# EAGLE design PressureSensorAdaptor (EAGLE 7.2.0)
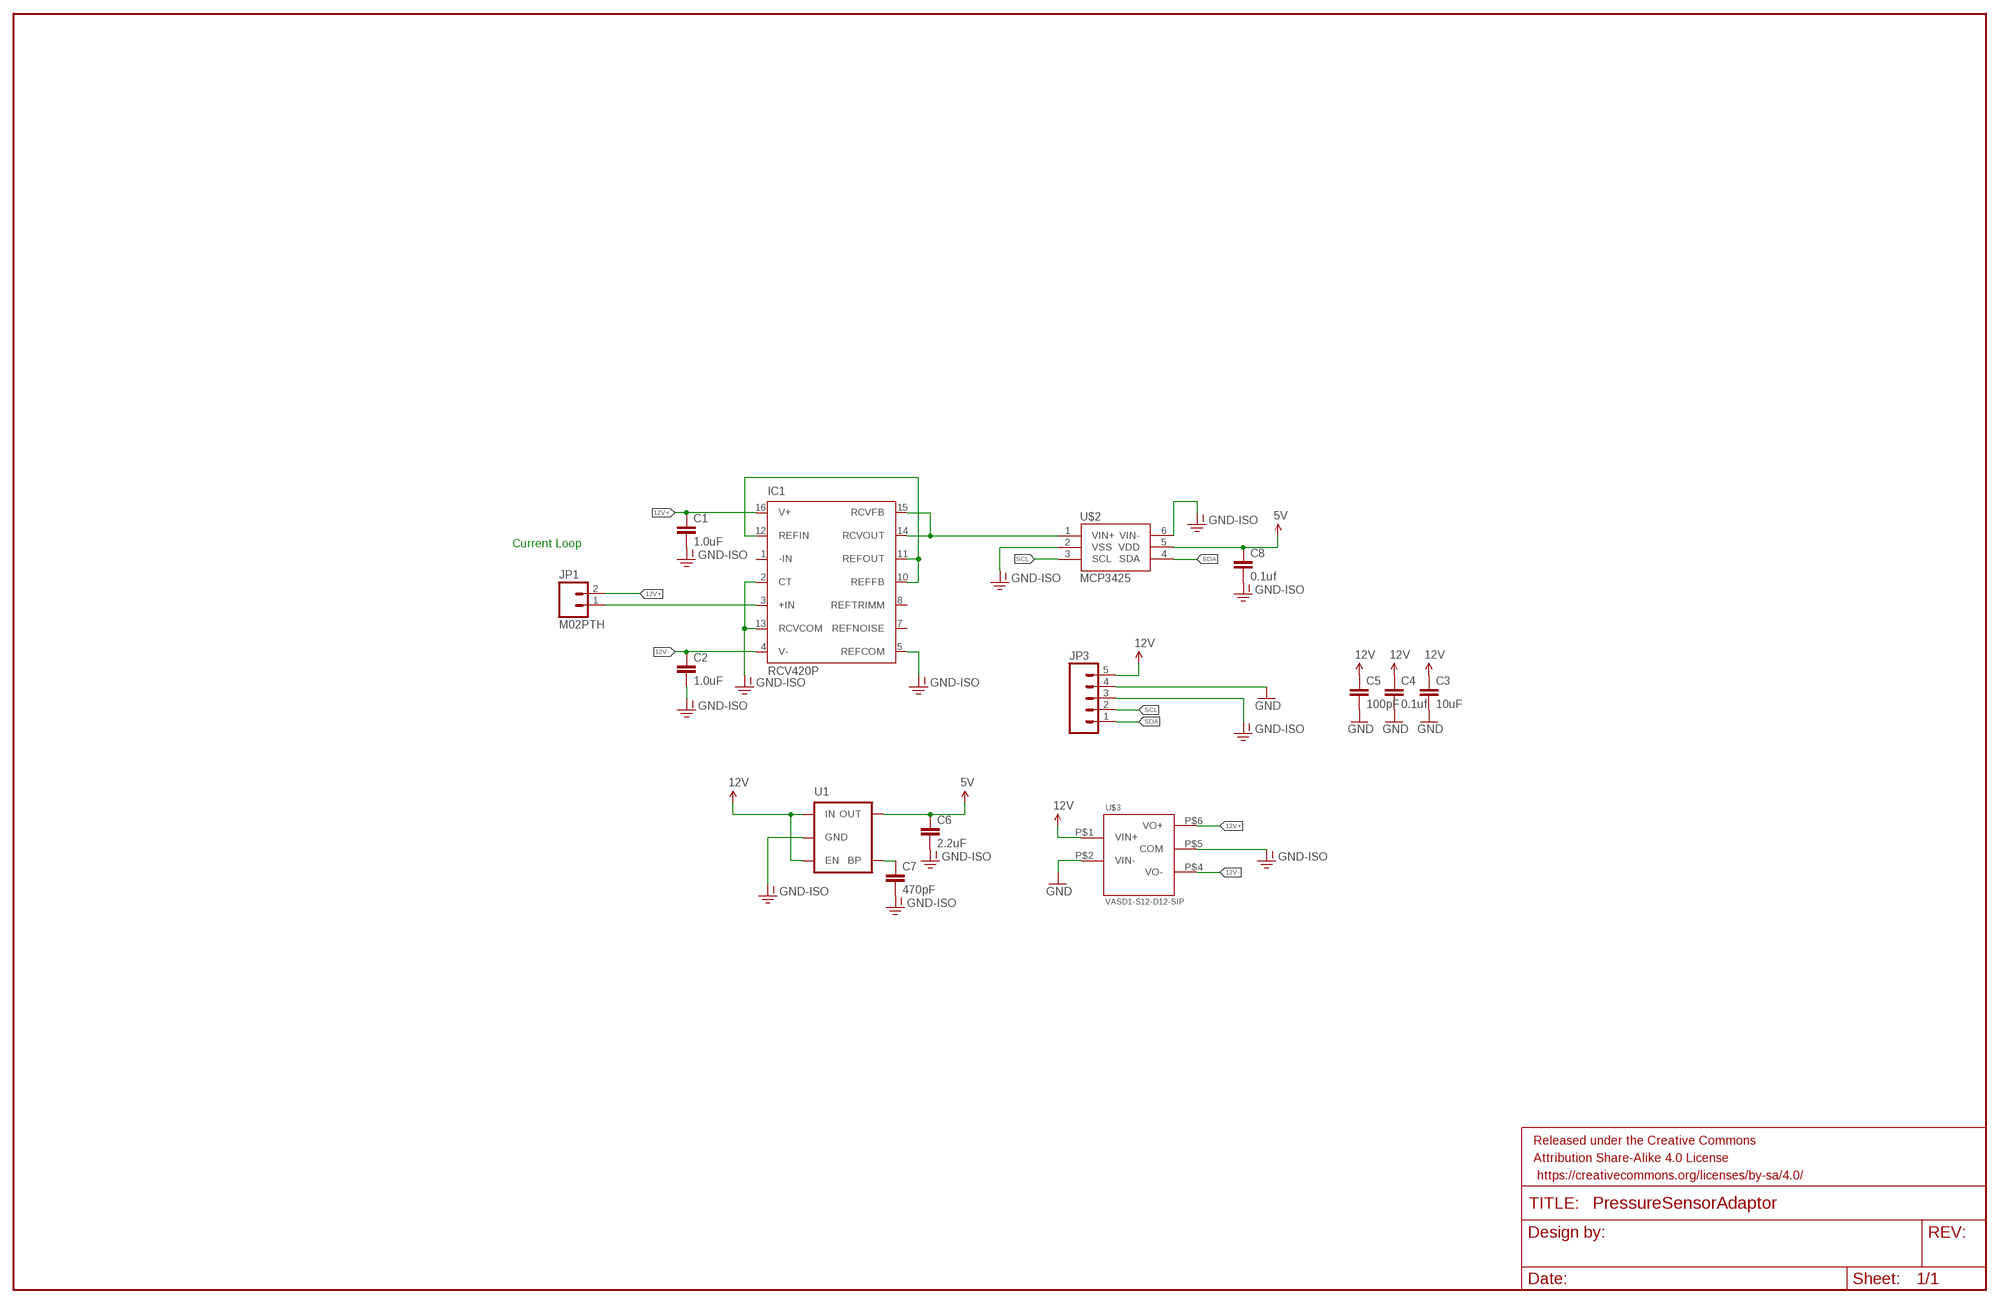
[diagram p0: schematic, sheet 1]

## Parts
C1  1.0uF  1.0UF-25V-+80/-20(0805)  [0805]
C2  1.0uF  1.0UF-25V-+80/-20(0805)  [0805]
C3  10uF  CAP0805  [0805]
C4  0.1uf  CAP0805  [0805]
C5  100pF  CAP0805  [0805]
C6  2.2uF  2.2UF-25V-+80/-20(0805)  [0805]
C7  470pF  470PF-50V-5%(0603)SMD  [0603-CAP]
C8  0.1uf  CAP0805  [0805]
FRAME1  FRAME-LEDGER  [CREATIVE_COMMONS]
IC1  RCV420P  [DIL16]
JP1  M02PTH  [1X02]
JP3  M05PTH  [1X05]
U1  MIC52055V  [SOT23-5]
U$2  MCP3425  [SOT23-6]
U$3  VASD1-S12-D12-SIP  [VASD1-S12-D12-SIP]

## Nets
5V: C6.1 C8.1 U1.5(OUT) U$2.5(VDD)
12V: C3.1 C4.1 C5.1 JP3.5 U1.1(IN) U1.3(EN) U$3.P$1(VIN+)
12V+: C1.1 IC1.16(V+) JP1.2 U$3.P$6(VO+)
12V-: C2.1 IC1.4(V-) U$3.P$4(VO-)
GND: C3.2 C4.2 C5.2 JP3.4 U$3.P$2(VIN-)
GND-ISO: C1.2 C2.2 C6.2 C7.2 C8.2 IC1.2(CT) IC1.5(REFCOM) IC1.13(RCVCOM) JP3.3 U1.2(GND) U$2.2(VSS) U$2.6(VIN-) U$3.P$5(COM)
N$1: IC1.10(REFFB) IC1.11(REFOUT) IC1.12(REFIN)
N$2: IC1.3(+IN) JP1.1
N$11: C7.1 U1.4(BP)
SCL: JP3.2 U$2.3(SCL)
SDA: JP3.1 U$2.4(SDA)
VOUT: IC1.14(RCVOUT) IC1.15(RCVFB) U$2.1(VIN+)
Unconnected: IC1.1(-IN) IC1.7(REFNOISE) IC1.8(REFTRIMM)

## Notes on the sheet
- Current Loop

## Library data of the parts
C1 C2 = SparkFun-Capacitors:1.0UF-25V-+80/-20(0805): CAP-11625; PROD_ID: CAP-11625
C3 = SparkFun-Capacitors:CAP: Capacitor Standard 0603 ceramic capacitor, and 0.1" leaded capacitor.; DIGIKEY: 490-3886-1-ND
C4 C5 C8 = SparkFun-Capacitors:CAP: Capacitor Standard 0603 ceramic capacitor, and 0.1" leaded capacitor.
C6 = SparkFun-Capacitors:2.2UF-25V-+80/-20(0805): CAP-11624; PROD_ID: CAP-11624
C7 = SparkFun-Capacitors:470PF-50V-5%(0603): CAP-07884; PROD_ID: CAP-07884
FRAME1 = SparkFun-Aesthetics:FRAME-LEDGER: Schematic Frame Standard 11x14 US Ledger frame; DESIGNER: Roy Cohen; VERSION: A
IC1 = burr-brown:RCV420: Precision 4mA to 20mA CURRENT LOOP RECEIVER Source: http://focus.ti.com/lit/ds/symlink/rcv420.pdf; MF: TEXAS INSTRUMENTS; MPN: RCV420JP; OC_FARNELL: 1212342; OC_NEWARK: 60K6765
JP1 = SparkFun-Connectors:M02: Standard 2-pin 0.1" header. Use with - straight break away headers ( PRT-00116) - right angle break away headers (PRT-00553) - swiss pins (PRT-00743) - machine pins (PRT-00117) - female headers (PRT-00115) Molex polarized connector foot print use with: PRT-08233 with associated crimp pins and housings. 2.54_SCREWTERM for use with PRT-10571. 3.5mm Screw Terminal footprints for PRT-08084 5mm Screw Terminal footprints for use with PRT-08432
JP3 = SparkFun-Connectors:M05: Header 5 Standard 5-pin 0.1" header. Use with straight break away headers (SKU : PRT-00116), right angle break away headers (PRT-00553), swiss pins (PRT-00743), machine pins (PRT-00117), and female headers (PRT-00115). Molex polarized connector foot print use with SKU : PRT-08230 with associated crimp pins and housings.
U1 = SparkFun-PowerIC:MIC5205: MIC5205 150mA vreg 3.3V - VREG-00822 5V - VREG-00823; PROD_ID: VREG-00823
U$2 = RitLaunchInitiative:MCP3425: Single channel ADC http://ww1.microchip.com/downloads/en/DeviceDoc/22072b.pdf
U$3 = RitLaunchInitiative:VASD1-S12-D12-SIP: DC to DC converter 12v to +12v, -12v http://www.cui.com/product/resource/vasd1-sip.pdf

## Board
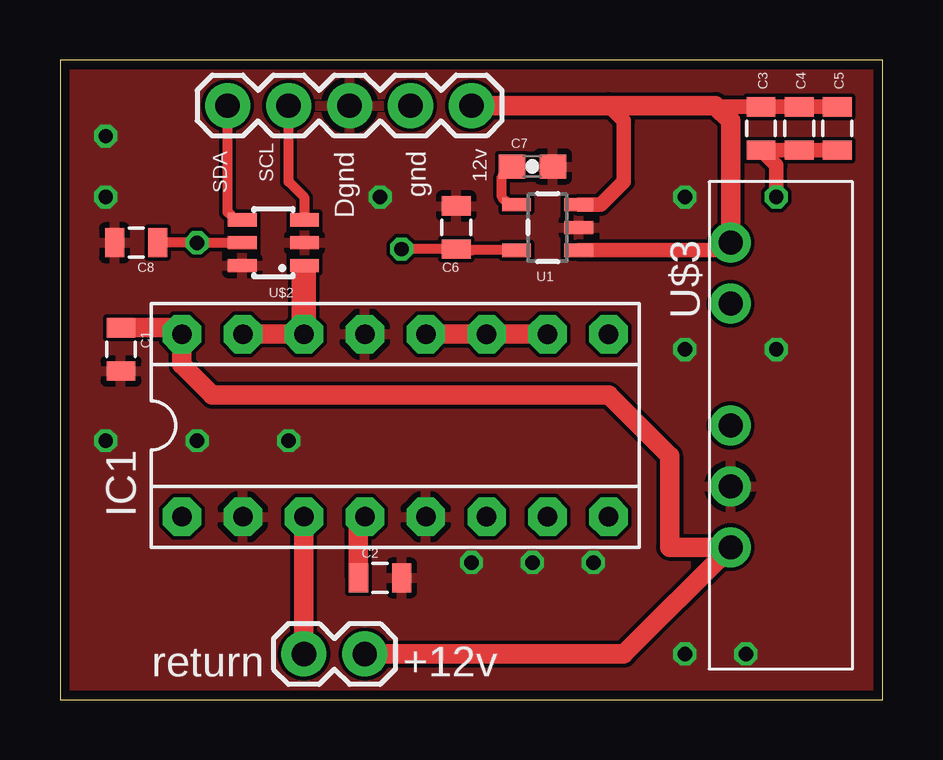
[diagram p1: board, top side]
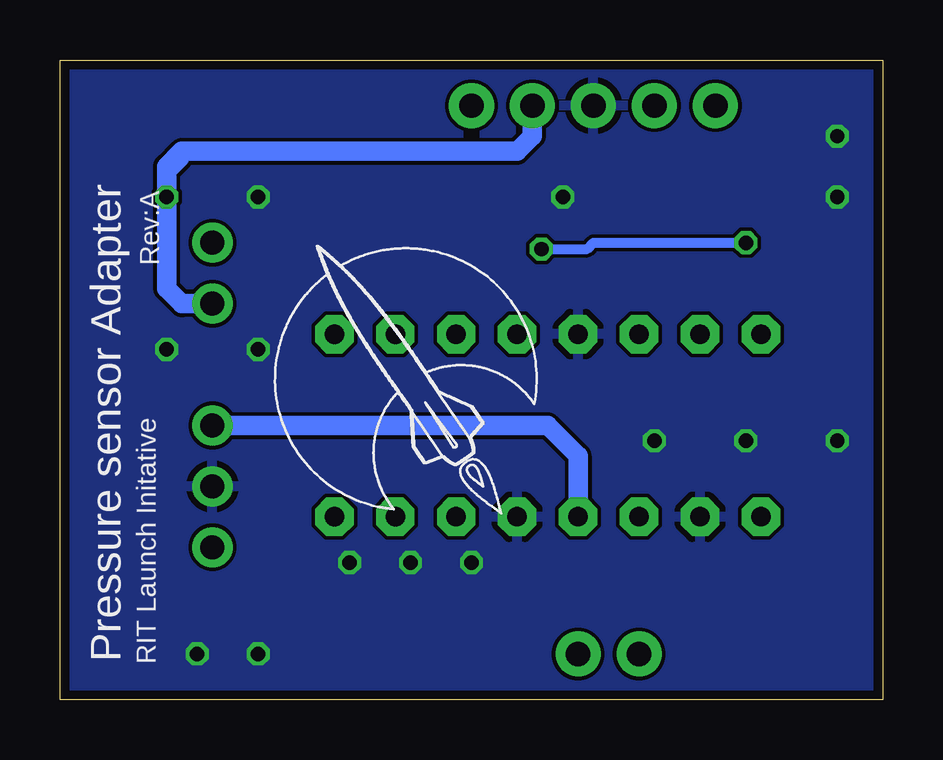
[diagram p2: board, bottom side, seen from below]

Size 34.29 x 26.67 mm. Coordinates in mm from the lower left corner, seen from the top.
Outline: 0,0 34.29,0 34.29,26.67 0,26.67 0,0
Copper layers (1*16): Top 0.0356mm / dielectric 1.5011mm / Bottom 0.0356mm
Design rules "LaenPCBOrder *": minimum track width 6mil, minimum drill 13mil, track to track 6mil, track to pad 6mil, pad to pad 6mil, via to via 6mil, smd to smd 6mil, copper to edge 15mil, drill to drill 6mil, minimum pad ring 7mil, minimum via ring 7mil, stop-mask expansion 3mil, vias tented up to drill 15mil, thermal gap 10mil

### Footprints (pad centres in the part's own frame; a part is rotated, then mirrored left to right if it is on the bottom)
0805 = smd 0.8 x 1.2: 1 -0.9,0; 2 0.9,0
0603-CAP = smd 1.1 x 1: 1 -0.85,0; 2 0.85,0
DIL16 = drill 0.813 pad 1.6 octagon: 1 -8.89,-3.81; 2 -6.35,-3.81; 3 -3.81,-3.81; 4 -1.27,-3.81; 5 1.27,-3.81; 6 3.81,-3.81; 7 6.35,-3.81; 8 8.89,-3.81; 9 8.89,3.81; 10 6.35,3.81; 11 3.81,3.81; 12 1.27,3.81; 13 -1.27,3.81; 14 -3.81,3.81; 15 -6.35,3.81; 16 -8.89,3.81
1X02 = drill 1.016 pad 1.88: 1 0,0; 2 2.54,0
1X05 = drill 1.016 pad 1.88: 1 0,0; 2 2.54,0; 3 5.08,0; 4 7.62,0; 5 10.16,0
SOT23-5 = smd 0.55 x 1.2: 1 -0.95,-1.3; 2 0,-1.3; 3 0.95,-1.3; 4 0.95,1.3; 5 -0.95,1.3
SOT23-6 = smd 1.2 x 0.55: 1 -1.3,0.95; 2 -1.3,0; 3 -1.3,-0.95; 4 1.3,-0.95; 5 1.3,0; 6 1.3,0.95
VASD1-S12-D12-SIP = drill 1 pad 1.676: P$1 0,0; P$2 2.54,0; P$4 7.62,0; P$5 10.16,0; P$6 12.7,0

### Placement (x,y rotation side)
C1  2.54,14.61 270 top
C2  13.34,5.08 0 top
C3  29.21,23.81 270 top
C4  30.8,23.81 270 top
C5  32.38,23.81 270 top
C6  16.51,19.68 90 top
C7  19.68,22.23 0 top
C8  3.17,19.05 180 top
FRAME1  -5.08,-3.81 0 top  (outside the outline)
IC1  13.97,11.43 0 top
JP1  10.16,1.91 0 top
JP3  6.99,24.77 0 top
U1  20.32,19.68 90 top
U$1  [RITLAUNCH_LOGO_SMALLB]  20.32,13.97 0 top
U$2  8.89,19.05 180 top
U$3  27.94,19.05 270 top

### Tracks (layer width: path | path; a pad name or v marks a point on that pad's centre or on a via)
5V  (via drill 0.6)
  Top 0.406: U1.5 17.2,18.73 C6.1 v14.23,18.79 | U$2.5 v5.71,19.05 C8.1
  Bottom 0.406: v14.23,18.79 12.33,18.79 12.06,19.05 v5.71,19.05
12V
  Top 0.61: U1.1 27.62,18.73 U$3.P$1 | U1.3 22.54,20.64 23.5,21.59 23.5,24.13 22.86,24.77 | 27.3,24.77 27.36,24.71 C3.1 C4.1 C5.1
  Top 0.813: JP3.5 22.86,24.77 27.3,24.77 27.94,24.13 U$3.P$1
12V+
  Top 0.813: JP1.2 23.5,1.91 U$3.P$6 25.4,6.35 25.4,10.16 22.86,12.7 6.35,12.7 5.08,13.97 IC1.16 4.82,15.51 C1.1
12V-
  Top 0.813: C2.1 12.44,7.36 IC1.4
  Bottom 0.813: U$3.P$4 13.97,11.43 12.7,10.16 IC1.4
GND  (via drill 0.6)
  Top 0.61: C5.2 C4.2 C3.2 29.84,22.28 v29.84,20.95
  Bottom 0.61: 29.21,22.86 29.21,22.54 29.84,21.91
  Bottom 0.813: JP3.4 14.61,23.5 15.24,22.86 29.21,22.86 29.84,22.23 29.84,21.91 v29.84,20.95 29.84,17.14 29.21,16.51 U$3.P$2
GND-ISO  (via drill 0.6)
  other vias: 26.04,20.95 22.23,5.71 19.68,5.71 17.14,5.71 1.91,23.5 1.91,20.95 28.57,1.91 26.04,14.61 13.34,20.95 1.91,10.79 5.71,10.79 9.53,10.79 26.04,1.91 29.84,14.61
  pour Top: 0,33.02 40.64,33.02 40.64,0 0,0
  pour Bottom: 0,36.83 40.64,35.56 40.64,0 0,0
N$1
  Top 0.813: IC1.12 IC1.11 IC1.10
N$2
  Top 0.813: JP1.1 IC1.3
N$11
  Top 0.406: U1.4 18.73,20.64 18.41,20.95 18.41,21.8 C7.1
SCL
  Top 0.406: U$2.3 10.19,20.93 9.53,21.59 JP3.2
SDA
  Top 0.406: U$2.4 7.3,20 6.99,20.32 JP3.1
VOUT
  Top 0.406: U$2.1 10.19,15.27 IC1.14
  Top 0.813: IC1.14 IC1.15
  Top 1.016: IC1.14 10.16,17.78

### Text on the board
tPlace: SDA | Dgnd | SCL | 12v | gnd | return | +12v
bPlace: Rev:A | RIT Launch Initative | Pressure sensor Adapter